# EAGLE schematic Lamp Logic Board_3 (EAGLE 9.4.2)
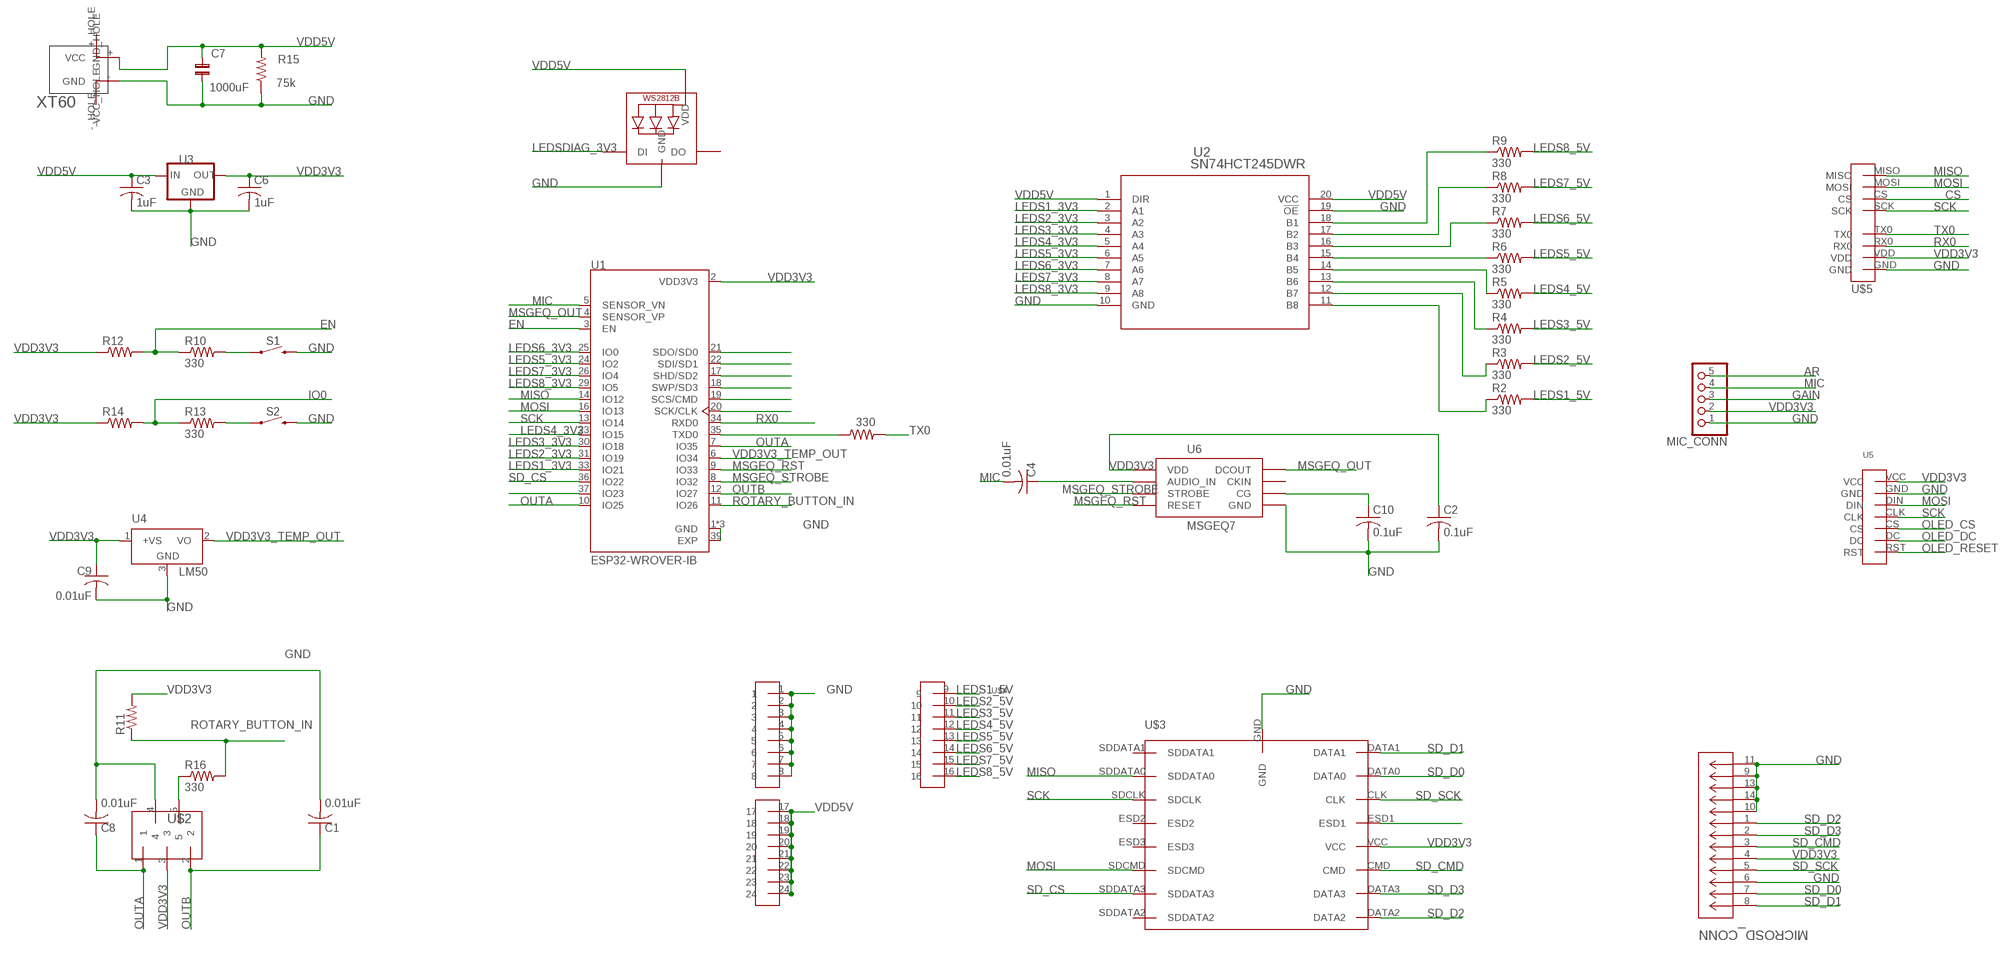
[diagram p0: schematic, sheet 1]

## Parts
C1  0.01uF  C-USC0402  [C0402]
C2  0.1uF  C-USC0805  [C0805]
C3  1uF  C-USC0402  [C0402]
C4  0.01uF  C-USC0402  [C0402]
C6  1uF  C-USC0402  [C0402]
C7  1000uF  C-BP-2,0X5  [ENP2,0-5]
C8  0.01uF  C-USC0402  [C0402]
C9  0.01uF  C-USC0402  [C0402]
C10  0.1uF  C-USC0805  [C0805]
LED1  WS2812B5050  [WS2812B]
MIC_CONN  PINHD-1X5  [1X05]
MICROSD_CONN  LLC  [CON00218_8]
R1  330  R-US_R1206  [R1206]
R2  330  R-US_R1206  [R1206]
R3  330  R-US_R1206  [R1206]
R4  330  R-US_R1206  [R1206]
R5  330  R-US_R1206  [R1206]
R6  330  R-US_R1206  [R1206]
R7  330  R-US_R1206  [R1206]
R8  330  R-US_R1206  [R1206]
R9  330  R-US_R1206  [R1206]
R10  330  R-US_R1206  [R1206]
R11  R-US_R0603  [R0603]
R12  R-US_R0603  [R0603]
R13  330  R-US_R1206  [R1206]
R14  R-US_R0603  [R0603]
R15  75k  R-US_0309/12  [0309/12]
R16  330  R-US_R1206  [R1206]
S1  MOMENTARY-SWITCH-SPST-SMD-6.0X3.5MM  [TACTILE_SWITCH_SMD_6.0X3.5MM]
S2  MOMENTARY-SWITCH-SPST-SMD-6.0X3.5MM  [TACTILE_SWITCH_SMD_6.0X3.5MM]
U1  ESP32-WROVER-IB  ESP32-WROVER-I  [XCVR_ESP32-WROVER-I]
U2  SN74HCT245DWR  [DW20]
U3  LM1117MP-1.8  [SOT223]
U4  LM50  [SOT23]
U5  SPIOLED_STANDOFF  [SPIOLED_STADOFF]
U6  MSGEQ7DIL  [DIL-08]
U$1  XT60  [XT60]
U$2  EN11-HSM1AF15  [EN11-HSM]
U$3  CM1624-08DE  [CM1624-08DE]
U$4  3X8PINHEAD  [3X8PINHEAD]
U$5  2X4PINHEAD  [2X4PINHEAD]

## Nets
AR: MIC_CONN.5
CS: U$5.CS
EN: R10.1 R12.2 U1.3(EN)
GAIN: MIC_CONN.3
GND: C1.2 C2.2 C3.2 C6.2 C7.1 C8.2 C9.2 C10.2 LED1.3-GND(GND) MIC_CONN.1 MICROSD_CONN.6 MICROSD_CONN.9 MICROSD_CONN.10 MICROSD_CONN.11 MICROSD_CONN.13 MICROSD_CONN.14 R15.1 S1.2 S2.2 U1.1(GND) U1.15(GND) U1.38(GND) U1.39(EXP) U2.10(GND) U2.19(!OE) U3.1(GND) U4.3(GND) U5.GND U6.2(GND) U$1.-(GND) U$2.4 U$3.GND U$4.1 U$4.2 U$4.3 U$4.4 U$4.5 U$4.6 U$4.7 U$4.8 U$5.GND
IO0: R13.1 R14.2
LEDS1_3V3: U1.33(IO21) U2.2(A1)
LEDS1_5V: R2.2 U$4.9
LEDS2_3V3: U1.31(IO19) U2.3(A2)
LEDS2_5V: R3.2 U$4.10
LEDS3_3V3: U1.30(IO18) U2.4(A3)
LEDS3_5V: R4.2 U$4.11
LEDS4_3V3: U1.23(IO15) U2.5(A4)
LEDS4_5V: R5.2 U$4.12
LEDS5_3V3: U1.24(IO2) U2.6(A5)
LEDS5_5V: R6.2 U$4.13
LEDS6_3V3: U1.25(IO0) U2.7(A6)
LEDS6_5V: R7.2 U$4.14
LEDS7_3V3: U1.26(IO4) U2.8(A7)
LEDS7_5V: R8.2 U$4.15
LEDS8_3V3: U1.29(IO5) U2.9(A8)
LEDS8_5V: R9.2 U$4.16
LEDSDIAG_3V3: LED1.4-DIN(DI)
MIC: C4.2 MIC_CONN.4 U1.5(SENSOR_VN)
MISO: U1.14(IO12) U$3.SDDATA0 U$5.MISO
MOSI: U1.16(IO13) U5.DIN U$3.SDCMD U$5.MOSI
MSGEQ_OUT: U1.4(SENSOR_VP) U6.3(DCOUT)
MSGEQ_RST: U1.9(IO33) U6.7(RESET)
MSGEQ_STROBE: U1.8(IO32) U6.4(STROBE)
N$1: R9.1 U2.18(B1)
N$2: R1.1 U1.35(TXD0)
N$3: C4.1 U6.5(AUDIO_IN)
N$4: C10.1 U6.6(CG)
N$5: R16.1 U$2.5
N$6: R8.1 U2.17(B2)
N$7: R13.2 S2.1
N$8: U$3.ESD1
N$9: R10.2 S1.1
N$10: R7.1 U2.16(B3)
N$11: R6.1 U2.15(B4)
N$12: R5.1 U2.14(B5)
N$13: R4.1 U2.13(B6)
N$14: R3.1 U2.12(B7)
N$15: R2.1 U2.11(B8)
N$30: U1.37(IO23)
N$38: U1.20(SCK/CLK)
N$39: U1.19(SCS/CMD)
N$40: U1.18(SWP/SD3)
N$41: U1.17(SHD/SD2)
N$42: U1.22(SDI/SD1)
N$43: U1.21(SDO/SD0)
OLED_CS: U5.CS
OLED_DC: U5.DC
OLED_RESET: U5.RST
OUTA: C8.1 U1.7(IO35) U1.10(IO25) U$2.1
OUTB: C1.1 U1.12(IO27) U$2.2
ROTARY_BUTTON_IN: R11.1 R16.2 U1.11(IO26)
RX0: U1.34(RXD0) U$5.RX0
SCK: U1.13(IO14) U5.CLK U$3.SDCLK U$5.SCK
SD_CMD: MICROSD_CONN.3 U$3.CMD
SD_CS: U1.36(IO22) U$3.SDDATA3
SD_D0: MICROSD_CONN.7 U$3.DATA0
SD_D1: MICROSD_CONN.8 U$3.DATA1
SD_D2: MICROSD_CONN.1 U$3.DATA2
SD_D3: MICROSD_CONN.2 U$3.DATA3
SD_SCK: MICROSD_CONN.5 U$3.CLK
TX0: R1.2 U$5.TX0
VDD3V3: C2.1 C6.1 C9.1 MIC_CONN.2 MICROSD_CONN.4 R11.2 R12.1 R14.1 U1.2(VDD3V3) U3.2(OUT) U3.4(OUT) U4.1(+VS) U5.VCC U6.1(VDD) U$2.3 U$3.VCC U$5.VDD
VDD3V3_TEMP_OUT: U1.6(IO34) U4.2(VO)
VDD5V: C3.1 C7.2 LED1.1-VDD(VDD) R15.2 U2.1(DIR) U2.20(VCC) U3.3(IN) U$1.+(VCC) U$4.17 U$4.18 U$4.19 U$4.20 U$4.21 U$4.22 U$4.23 U$4.24
Unconnected: LED1.2-DOUT(DO) U6.8(CKIN) U$1.+_HOLE(VCC_HOLE) U$1.-_HOLE(GND_HOLE) U$3.ESD2 U$3.ESD3 U$3.SDDATA1 U$3.SDDATA2

## Library data of the parts
C1-C4 C6 C8-C10 = resistor:C-US: CAPACITOR, American symbol
C7 = cap-pan40:C-BP: BIPOLAR ELECTROLYTIC
LED1 = WS2812B:WS2812B; AVAILABILITY: Unavailable; DESCRIPTION: Intelligent Control Led Integrated Light Source Pack Of 10; MF: Seeed Technology; MP: WS2812B; PACKAGE: None; PRICE: None
MIC_CONN = pinhead:PINHD-1X5: PIN HEADER
MICROSD_CONN = 5027740891:LLC; MANUFACTURER_PART_NUMBER: LLC; VENDOR: Molex Connector Corporation
R1-R16 = resistor:R-US_: RESISTOR, American symbol
S1 S2 = SparkFun-Switches:MOMENTARY-SWITCH-SPST: Momentary Switch (Pushbutton) - SPST Normally-open (NO) SPST momentary switches (buttons, pushbuttons). Variants PTH-12MM - 12mm square, through-hole Momentary Pushbutton Switch - 12mm Square <https://www.sparkfun.com/products/9190> (COM-09190) PTH-6.0MM, PTH-6.0MM-KIT - 6.0mm square, through-hole Mini Pushbutton Switch <https://www.sparkfun.com/products/97> (COM-00097) KIT package intended for soldering kit's - only one side of pads' copper is exposed. PTH-RIGHT-ANGLE-KIT - Right-angle, through-hole Right Angle Tactile Button <https://www.sparkfun.com/products/10791> - Used on SparkFun BigTime Watch Kit <https://www.sparkfun.com/products/11734> SMD-12MM - 12mm square, surface-mount Tactile Button - SMD (12mm) <https://www.sparkfun.com/products/12993> (COM-12993) Used on SparkFun PicoBoard <https://www.sparkfun.com/products/11888> SMD-4.5MM - 4.5mm Square Trackball Switch Used on SparkFun Blackberry Trackballer Breakout <https://www.sparkfun.com/products/13169> SMD-4.6MMX2.8MM - 4.60mm x 2.80mm, surface mount Used on SparkFun SAMD21 Mini Breakout <https://www.sparkfun.com/products/13664> SMD-5.2MM, SMD-5.2-REDUNDANT - 5.2mm square, surface-mount Mini Pushbutton Switch - SMD <https://www.sparkfun.com/products/8720> (COM-08720) Used on Arduino Pro Mini <https://www.sparkfun.com/products/11114> REDUNDANT package connects both switch circuits together SMD-6.0X3.5MM - 6.0 x 3.5mm, surface mount Momentary Reset Switch SMD <https://www.sparkfun.com/products/8229> (COM-08229) SMD-6.2MM-TALL - 6.2mm square, surface mount Tactile Button - SMD (6mm) <https://www.sparkfun.com/products/12992> Used on SparkFun Digital Sandbox <https://www.sparkfun.com/products/12651> SMD-RIGHT-ANGLE - Right-angle, surface mount Used on SparkFun Block for Intel® Edison - Arduino <https://www.sparkfun.com/products/13036>; PROD_ID: SWCH-00815; SF_SKU: COM-08229
U1 = ESP32-WROVER-I:ESP32-WROVER-I: Module: combo; GPIO, I2C x2, I2S x2, SDIO, SPI x3, UART x3; U.FL; AVAILABILITY: Unavailable; DESCRIPTION: Module: combo; GPIO, I2C x2, I2S x2, SDIO, SPI x3, UART x3; U.FL; MF: Espressif Systems; MP: ESP32-WROVER-I; PACKAGE: Module Espressif Systems; PRICE: None
U2 = SN74HCT245DWR :SN74HCT245DWR; MANUFACTURER_PART_NUMBER: SN74HCT245DWR; VENDOR: Texas Instruments
U3 = lm1117:LM1117?-*: 800mA Low-Dropout Linear Regulator Source: http://ww1.microchip.com/downloads/en/DeviceDoc/39760d.pdf; MF: Texas Instruments; MPN: LM1117MP-1.8; OC_FARNELL: 1469053; OC_NEWARK: 41K3467
U4 = linear:LM50: SOT-23 Single-Supply Centigrade Temperature Sensor Vout = (10mV/°C x Temp °C) +5mmmV Source: http://cache.national.com/ds/LM/LM50.pdf
U5 = SPIOLED-STANDOFF:SPIOLED_STANDOFF
U6 = MSGEQ7:MSGEQ7: 7-band graphic equalizer; DESCRIPTION: Seven Band Graphic Equalizer Display Filter; DIGI-KEY_PART_NUMBER: 1568-1544-ND; DIGI-KEY_PURCHASE_URL: https://www.digikey.com/product-detail/en/sparkfun-electronics/DEV-13116/1568-1544-ND/5764478?utm_source=snapeda&utm_medium=aggregator&utm_campaign=symbol; MF: SparkFun Electronics; MP: MSGEQ7; PACKAGE: SOIC-8 Mixed Signal Integration
U$1 = XT60:XT60: XT60
U$2 = untitled:EN11-HSM1AF15
U$3 = CM1624-08DE:CM1624-08DE
U$4 = 3X8PINHEAD:3X8PINHEAD
U$5 = 2X4PINHEAD:2X4PINHEAD